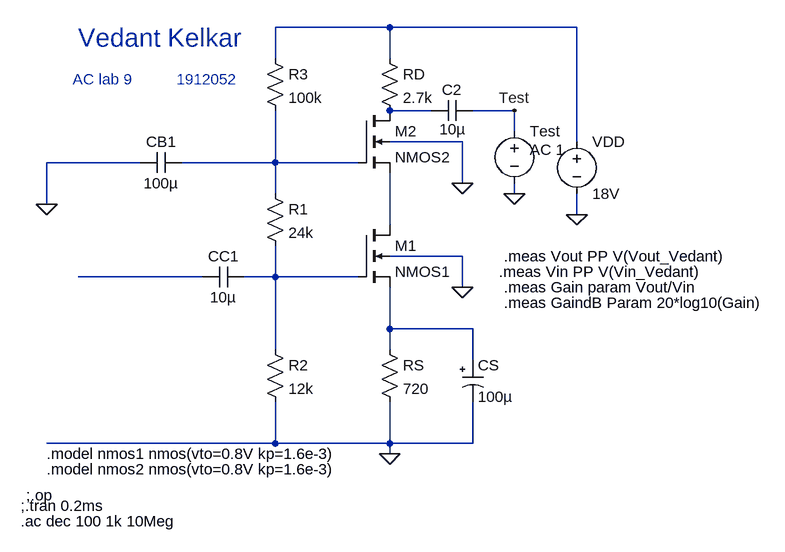
[diagram p0: schematic AC_Lab9.asc]
AC_Lab9.asc, the LTspice schematic file:
Version 4
SHEET 1 880 680
WIRE 160 -208 -16 -208
WIRE 448 -208 160 -208
WIRE -16 -160 -16 -208
WIRE 160 -160 160 -208
WIRE 224 -80 160 -80
WIRE 352 -80 288 -80
WIRE 352 -48 352 -80
WIRE 272 -32 160 -32
WIRE 448 -32 448 -208
WIRE -224 0 -368 0
WIRE -16 0 -16 -80
WIRE -16 0 -160 0
WIRE 112 0 -16 0
WIRE 272 32 272 -32
WIRE -16 48 -16 0
WIRE 352 48 352 32
WIRE -368 64 -368 0
WIRE 448 80 448 48
WIRE 160 96 160 16
WIRE 272 144 160 144
WIRE -128 176 -320 176
WIRE -16 176 -16 128
WIRE -16 176 -64 176
WIRE 112 176 -16 176
WIRE 272 192 272 144
WIRE 160 256 160 192
WIRE 288 256 160 256
WIRE -16 288 -16 176
WIRE 160 288 160 256
WIRE 288 304 288 256
WIRE -16 432 -16 368
WIRE -16 432 -368 432
WIRE 160 432 160 368
WIRE 160 432 -16 432
WIRE 288 432 288 368
WIRE 288 432 160 432
WIRE 160 448 160 432
FLAG 160 448 0
FLAG 352 -80 Test
FLAG 448 80 0
FLAG -368 64 0
FLAG 272 32 0
FLAG 272 192 0
FLAG 352 48 0
SYMBOL res -32 32 R0
SYMATTR InstName R1
SYMATTR Value 24k
SYMBOL res 144 272 R0
SYMATTR InstName RS
SYMATTR Value 720
SYMBOL res -32 272 R0
SYMATTR InstName R2
SYMATTR Value 12k
SYMBOL cap -64 160 R90
WINDOW 0 0 32 VBottom 2
WINDOW 3 32 32 VTop 2
SYMATTR InstName CC1
SYMATTR Value 10µ
SYMBOL voltage 352 -64 R0
WINDOW 123 24 44 Left 2
WINDOW 39 0 0 Left 0
WINDOW 3 21 91 Left 2
SYMATTR Value2 AC 1
SYMATTR Value ""
SYMATTR InstName Test
SYMBOL polcap 272 304 R0
WINDOW 3 24 56 Left 2
SYMATTR Value 100µ
SYMATTR InstName CS
SYMATTR Description Capacitor
SYMATTR Type cap
SYMATTR SpiceLine V=6.3 Irms=2.21565 Rser=0.055 Lser=0 mfg="KEMET" pn="A700V106M006ATE055" type="Al electrolytic"
SYMBOL res -32 -176 R0
SYMATTR InstName R3
SYMATTR Value 100k
SYMBOL res 144 -176 R0
SYMATTR InstName RD
SYMATTR Value 2.7k
SYMBOL cap 288 -96 R90
WINDOW 0 0 32 VBottom 2
WINDOW 3 29 31 VTop 2
SYMATTR InstName C2
SYMATTR Value 10µ
SYMBOL voltage 448 -48 R0
WINDOW 123 0 0 Left 0
WINDOW 39 0 0 Left 0
SYMATTR InstName VDD
SYMATTR Value 18V
SYMBOL cap -160 -16 R90
WINDOW 0 0 32 VBottom 2
WINDOW 3 32 32 VTop 2
SYMATTR InstName CB1
SYMATTR Value 100µ
SYMBOL nmos4 112 96 R0
SYMATTR InstName M1
SYMATTR Value NMOS1
SYMBOL nmos4 112 -80 R0
SYMATTR InstName M2
SYMATTR Value NMOS2
TEXT -320 -192 Left 4 ;Vedant Kelkar
TEXT -328 -128 Left 2 ;AC lab 9
TEXT -168 -128 Left 2 ;1912052
TEXT -400 512 Left 2 !;.op
TEXT -408 528 Left 2 !;.tran 0.2ms
TEXT 336 144 Left 2 !.meas Vout PP V(Vout_Vedant)
TEXT 328 168 Left 2 !.meas Vin PP V(Vin_Vedant)
TEXT 336 192 Left 2 !.meas Gain param Vout/Vin
TEXT -368 448 Left 2 !.model nmos1 nmos(vto=0.8V kp=1.6e-3)
TEXT -368 472 Left 2 !.model nmos2 nmos(vto=0.8V kp=1.6e-3)
TEXT 336 216 Left 2 !.meas GaindB Param 20*log10(Gain)
TEXT -408 552 Left 2 !.ac dec 100 1k 10Meg

The netlist it stands for:
* AC_Lab9.asc
R1 N003 N006 24k
RS N007 0 720
R2 N006 0 12k
CC1 N006 N005 10µ
V§Test Test 0 AC 1
CS N007 0 100µ V=6.3 Irms=2.21565 Rser=0.055 Lser=0 mfg="KEMET" pn="A700V106M006ATE055" type="Al electrolytic"
R3 N001 N003 100k
RD N001 N002 2.7k
C2 Test N002 10µ
VDD N001 0 18V
CB1 N003 0 100µ
M1 N004 N006 N007 0 NMOS1
M2 N002 N003 N004 0 NMOS2
.model NMOS NMOS
.model PMOS PMOS
.lib standard.mos
* Vedant Kelkar
* AC lab 9
* 1912052
;.op
;.tran 0.2ms
.meas Vout PP V(Vout_Vedant)
.meas Vin PP V(Vin_Vedant)
.meas Gain param Vout/Vin
.model nmos1 nmos(vto=0.8V kp=1.6e-3)
.model nmos2 nmos(vto=0.8V kp=1.6e-3)
.meas GaindB Param 20*log10(Gain)
.ac dec 100 1k 10Meg
.backanno
.end